# Altium schematic sheet 11ethernetGbit.SchDoc
size B
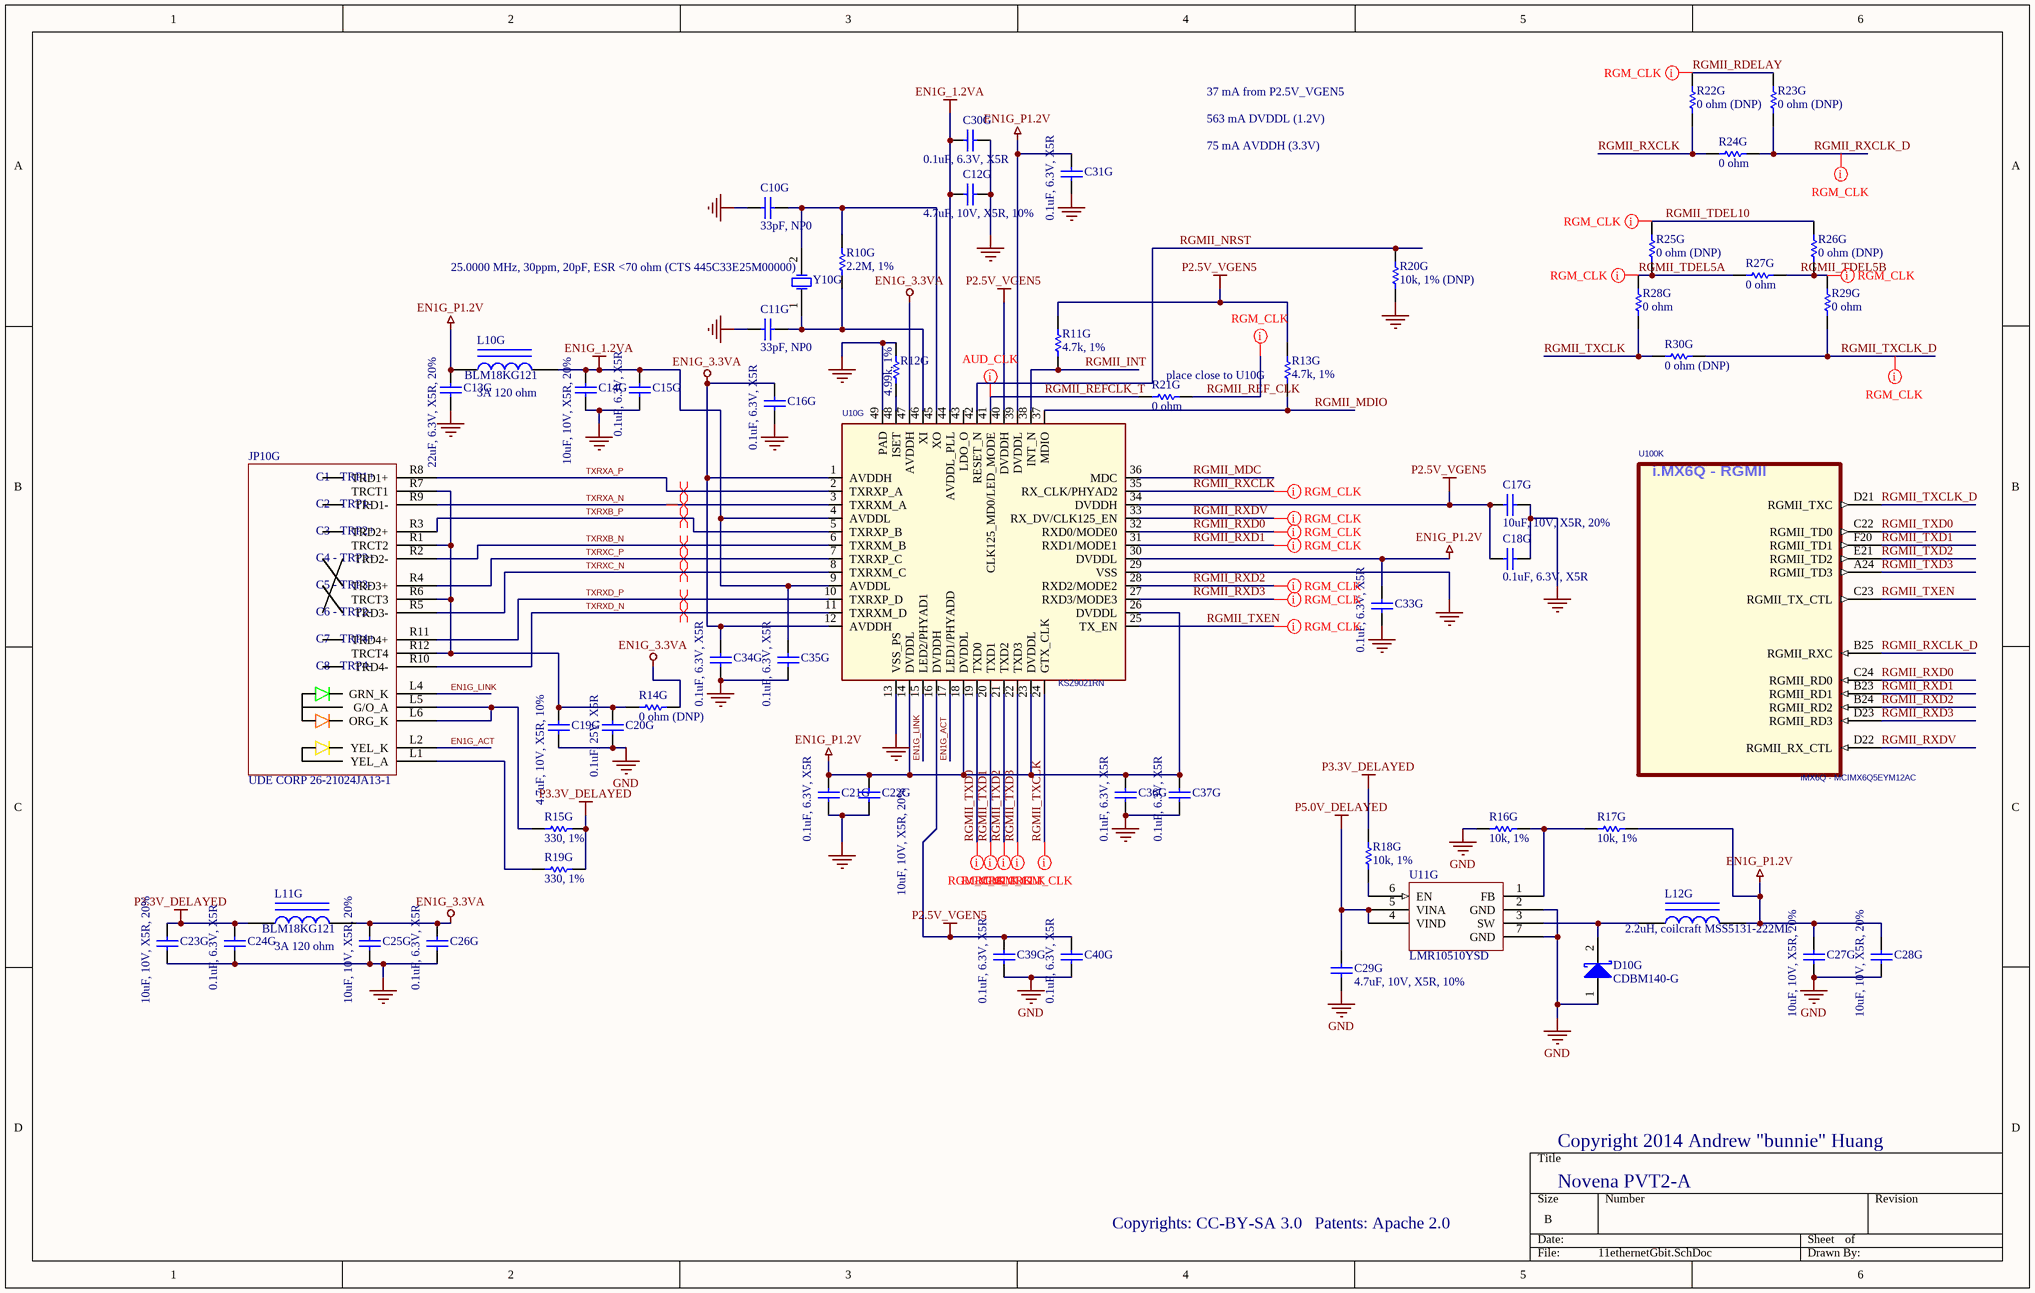
[diagram p0: 11ethernetGbit.SchDoc]

## Parts
C10G  33pF, NP0  [CAPC1005N]
C11G  33pF, NP0  [CAPC1005N]
C12G  4.7uF, 10V, X5R, 10%  [CAPC1608N]
C13G  22uF, 6.3V, X5R, 20%  [CAPC1608N_HD]
C14G  10uF, 10V, X5R, 20%  [CAPC1608N]
C15G  0.1uF, 6.3V, X5R  [CAPC0603N_B]
C16G  0.1uF, 6.3V, X5R  [CAPC0603N_B]
C17G  10uF, 10V, X5R, 20%  [CAPC1608N]
C18G  0.1uF, 6.3V, X5R  [CAPC0603N_B]
C19G  4.7uF, 10V, X5R, 10%  [CAPC1608N]
C20G  0.1uF, 25V, X5R  [CAPC1005N]
C21G  0.1uF, 6.3V, X5R  [CAPC0603N_B]
C22G  10uF, 10V, X5R, 20%  [CAPC1608N]
C23G  10uF, 10V, X5R, 20%  [CAPC1608N]
C24G  0.1uF, 6.3V, X5R  [CAPC0603N_B]
C25G  10uF, 10V, X5R, 20%  [CAPC1608N]
C26G  0.1uF, 6.3V, X5R  [CAPC0603N_B]
C27G  10uF, 10V, X5R, 20%  [CAPC1608N]
C28G  10uF, 10V, X5R, 20%  [CAPC1608N]
C29G  4.7uF, 10V, X5R, 10%  [CAPC1608N]
C30G  0.1uF, 6.3V, X5R  [CAPC0603N_B]
C31G  0.1uF, 6.3V, X5R  [CAPC0603N_B]
C33G  0.1uF, 6.3V, X5R  [CAPC0603N_B]
C34G  0.1uF, 6.3V, X5R  [CAPC0603N_B]
C35G  0.1uF, 6.3V, X5R  [CAPC0603N_B]
C36G  0.1uF, 6.3V, X5R  [CAPC0603N_B]
C37G  0.1uF, 6.3V, X5R  [CAPC0603N_B]
C39G  0.1uF, 6.3V, X5R  [CAPC0603N_B]
C40G  0.1uF, 6.3V, X5R  [CAPC0603N_B]
D10G  CDBM140-G  [SOD123]
JP10G  UDE CORP 26-21024JA13-1  [UDE_CORP_26-21024JA13-1]
L10G  BLM18KG121  value 3A 120 ohm  [INDC1608AN]
L11G  BLM18KG121  value 3A 120 ohm  [INDC1608AN]
L12G  2.2uH, coilcraft MSS5131-222ML  [COILCRAFT_MSS5121]
R10G  2.2M, 1%  [RESC1005N]
R11G  4.7k, 1%  [RESC1005N]
R12G  4.99k, 1%  [RESC1005N]
R13G  4.7k, 1%  [RESC1005N]
R14G  0 ohm (DNP)  [RESC1005N]
R15G  330, 1%  [RESC1005N]
R16G  10k, 1%  [RESC1005N]
R17G  10k, 1%  [RESC1005N]
R18G  10k, 1%  [RESC1005N]
R19G  330, 1%  [RESC1005N]
R20G  10k, 1% (DNP)  [RESC1005N]
R21G  0 ohm  [RESC1005N]
R22G  0 ohm (DNP)  [RESC1005N]
R23G  0 ohm (DNP)  [RESC1005N]
R24G  0 ohm  [RESC1005N]
R25G  0 ohm (DNP)  [RESC1005N]
R26G  0 ohm (DNP)  [RESC1005N]
R27G  0 ohm  [RESC1005N]
R28G  0 ohm  [RESC1005N]
R29G  0 ohm  [RESC1005N]
R30G  0 ohm (DNP)  [RESC1005N]
U10G  KSZ9021RN  [MICREL_QFN48_EP]
U11G  LMR10510YSD  [SON95P300X300X80-7V]
U100  iMX6Q - MCIMX6Q5EYM12AC  [FREESCALE_BGA624C80P25X25_2100X2100X216]  (part K of 12)
Y10G  25.0000 MHz, 30ppm, 20pF, ESR <70 ohm (CTS 445C33E25M00000)  [NDK_NX5032A]

## Nets
EN1G_1.2VA: C12G.1 C14G.1 C15G.1 C30G.2 C35G.1 L10G.2 U10G.4(AVDDL) U10G.9(AVDDL) U10G.44(AVDDL_PLL)
EN1G_3.3VA: C16G.1 C25G.1 C26G.1 C34G.1 L11G.2 R14G.2 U10G.1(AVDDH) U10G.12(AVDDH) U10G.47(AVDDH)
EN1G_P1.2V: C13G.1 C21G.1 C22G.1 C27G.2 C28G.2 C31G.1 C33G.1 C36G.1 C37G.1 L10G.1 L12G.2 R17G.1 U10G.14(DVDDL) U10G.18(DVDDL) U10G.23(DVDDL) U10G.26(DVDDL) U10G.30(DVDDL) U10G.39(DVDDL)
GND: C10G.1 C11G.1 C12G.2 C13G.2 C14G.2 C15G.2 C16G.2 C17G.2 C18G.2 C19G.2 C20G.2 C21G.2 C22G.2 C23G.2 C24G.2 C25G.2 C26G.2 C27G.1 C28G.1 C29G.2 C30G.1 C31G.2 C33G.2 C34G.2 C35G.2 C36G.2 C37G.2 C39G.2 C40G.2 D10G.1(A) R12G.2 R16G.2 R20G.1 U10G.13(VSS_PS) U10G.29(VSS) U10G.49(PAD) U11G.2(GND) U11G.7(GND)
P2.5V_VGEN5: C17G.1 C18G.1 C39G.1 C40G.1 R11G.2 R13G.2 U10G.16(DVDDH) U10G.34(DVDDH) U10G.40(DVDDH)
P3.3V_DELAYED: C23G.1 C24G.1 L11G.1 R15G.2 R18G.2 R19G.2
P5.0V_DELAYED: C29G.1 U11G.4(VIND) U11G.5(VINA)
EN1G_ACT: JP10G.L2(YEL_K) U10G.17(LED1/PHYADD)
EN1G_LINK: JP10G.L4(GRN_K) U10G.15(LED2/PHYAD1)
RGMII_INT: R11G.1 U10G.38(INT_N)
RGMII_MDC: U10G.36(MDC)
RGMII_MDIO: R13G.1 U10G.37(MDIO)
RGMII_NRST: R20G.2 U10G.42(RESET_N)
RGMII_RDELAY: R22G.2 R23G.2
RGMII_REF_CLK: R21G.2
RGMII_REFCLK_T: R21G.1 U10G.41(CLK125_MD0/LED_MODE)
RGMII_RXCLK: R22G.1 R24G.1 U10G.35(RX_CLK/PHYAD2)
RGMII_RXCLK_D: R23G.1 R24G.2 U100.B25(RGMII_RXC)
RGMII_RXD0: U10G.32(RXD0/MODE0) U100.C24(RGMII_RD0)
RGMII_RXD1: U10G.31(RXD1/MODE1) U100.B23(RGMII_RD1)
RGMII_RXD2: U10G.28(RXD2/MODE2) U100.B24(RGMII_RD2)
RGMII_RXD3: U10G.27(RXD3/MODE3) U100.D23(RGMII_RD3)
RGMII_RXDV: U10G.33(RX_DV/CLK125_EN) U100.D22(RGMII_RX_CTL)
RGMII_TDEL5A: R25G.1 R27G.2 R28G.2
RGMII_TDEL5B: R26G.1 R27G.1 R29G.2
RGMII_TDEL10: R25G.2 R26G.2
RGMII_TXCLK: R28G.1 R30G.1 U10G.24(GTX_CLK)
RGMII_TXCLK_D: R29G.1 R30G.2 U100.D21(RGMII_TXC)
RGMII_TXD0: U10G.19(TXD0) U100.C22(RGMII_TD0)
RGMII_TXD1: U10G.20(TXD1) U100.F20(RGMII_TD1)
RGMII_TXD2: U10G.21(TXD2) U100.E21(RGMII_TD2)
RGMII_TXD3: U10G.22(TXD3) U100.A24(RGMII_TD3)
RGMII_TXEN: U10G.25(TX_EN) U100.C23(RGMII_TX_CTL)
TXRXA_N: JP10G.R9(TRD1-) U10G.3(TXRXM_A)
TXRXA_P: JP10G.R8(TRD1+) U10G.2(TXRXP_A)
TXRXB_N: JP10G.R2(TRD2-) U10G.6(TXRXM_B)
TXRXB_P: JP10G.R3(TRD2+) U10G.5(TXRXP_B)
TXRXC_N: JP10G.R5(TRD3-) U10G.8(TXRXM_C)
TXRXC_P: JP10G.R4(TRD3+) U10G.7(TXRXP_C)
TXRXD_N: JP10G.R10(TRD4-) U10G.11(TXRXM_D)
TXRXD_P: JP10G.R11(TRD4+) U10G.10(TXRXP_D)
NetC10G_2: C10G.2 R10G.1 U10G.45(XO) Y10G.2(OSC2)
NetC11G_2: C11G.2 R10G.2 U10G.46(XI) Y10G.1(OSC1)
NetC19G_1: C19G.1 C20G.1 JP10G.R1(TRCT2) JP10G.R6(TRCT3) JP10G.R7(TRCT1) JP10G.R12(TRCT4) R14G.1
NetD10G_2: D10G.2(K) L12G.1 U11G.3(SW)
NetJP10G_L1: JP10G.L1(YEL_A) R19G.1
NetJP10G_L5: JP10G.L5(G/O_A) JP10G.L6(ORG_K) R15G.1
NetR12G_1: R12G.1 U10G.48(ISET)
NetR16G_1: R16G.1 R17G.2 U11G.1(FB)
NetR18G_1: R18G.1 U11G.6(EN)

Not connected (* = marked no-connect by the designer): U10G 43(LDO_O)

## Layout directives
differential pair: TXRXA_N, TXRXA_P, TXRXB_N, TXRXB_P, TXRXC_N, TXRXC_P, TXRXD_N, TXRXD_P
net class RGM_CLK; Impedance: 50 ohm: RGMII_RDELAY, RGMII_REF_CLK, RGMII_RXCLK, RGMII_RXCLK_D, RGMII_RXD0, RGMII_RXD1, RGMII_RXD2, RGMII_RXD3, RGMII_RXDV, RGMII_TDEL5A, RGMII_TDEL5B, RGMII_TDEL10, RGMII_TXCLK, RGMII_TXCLK_D, RGMII_TXD0, RGMII_TXD1, RGMII_TXD2, RGMII_TXD3, RGMII_TXEN
net class AUD_CLK: RGMII_REFCLK_T

## Notes on the sheet
- 37 mA from P2.5V_VGEN5
- 563 mA DVDDL (1.2V)
- 75 mA AVDDH (3.3V)
- (near R13G) place close to U10G
- Copyright 2014 Andrew "bunnie" Huang
- Copyrights: CC-BY-SA 3.0
- Patents: Apache 2.0
- Novena PVT2-A
- (in symbol PCIMX6Q6VV1A, part K) i.MX6Q - RGMII
- (in symbol UDE_CORP_26-21024JA13-1) C1 - TRP1+; C2 - TRP1-; C3 - TRP2+; C4 - TRP3+; C5 - TRP3-; C6 - TRP2-; C7 - TRP4+; C8 - TRP4-

## Library data of the parts
C10G C11G C12G C13G C14G C15G C16G C17G C18G C19G C20G C21G C22G C23G C24G C25G C26G C27G C28G C29G C30G C31G C33G C34G C35G C36G C37G C39G C40G = Cap Semi: Capacitor (Semiconductor SIM Model); Published: 8-Jun-2000; LatestRevisionDate: 17-Jul-2002; LatestRevisionNote: Re-released for DXP Platform.; PackageReference: C1206; Publisher: Altium Limited
D10G = D Schottky: Schottky Diode; Code - JEDEC: DO-214-AA; Published: 8-Jun-2000; Publisher: Altium Limited; Revision: July-2002: Re-released for DXP Platform.
JP10G = UDE_CORP_26-21024JA13-1: 10/100/1000BT + magnetics, symmetric, tab up, with LEDs
L10G L11G L12G = Inductor Iron: Magnetic-Core Inductor; Published: 24-Mar-1999; LatestRevisionDate: 17-Jul-2002; LatestRevisionNote: Re-released for DXP Platform.; PackageReference: AXIAL-0.9; Publisher: Altium Limited
R10G R11G R12G R13G R14G R15G R16G R17G R18G R19G R20G R21G R22G R23G R24G R25G R26G R27G R28G R29G R30G = Res1: Resistor; Value: 100k; Published: 8-Jun-2000; LatestRevisionDate: 17-Jul-2002; LatestRevisionNote: Re-released for DXP Platform.; PackageReference: AXIAL-0.3; Publisher: Altium Limited
U10G = KSZ9021_0: Gigabit Ethernet PHY
U11G = LMR10515XSD: NatSemi 1.5A step-down regulator in LLP
U100 = PCIMX6Q6VV1A: PLACEHOLDER FOR FREESCALE PART NUMBER PMCIMX6Q6VV1A.; AGILE_PN: TMP-WF-14526; MFG_NAME01: Freescale Semiconductor; PRE_APN: 344-01218; MFG_PN01: PCIMX6Q6VV1A; ROHS: Yes; HEIGHT: 2.16MM
Y10G = XTAL: Crystal Oscillator; Published: 8-Jun-2000; LatestRevisionDate: 17-Jul-2002; LatestRevisionNote: Re-released for DXP Platform.; PackageReference: R38; Publisher: Altium Limited